# Altium schematic sheet Sheet3.SchDoc
size A; SheetNumber: 1; SheetTotal: 1
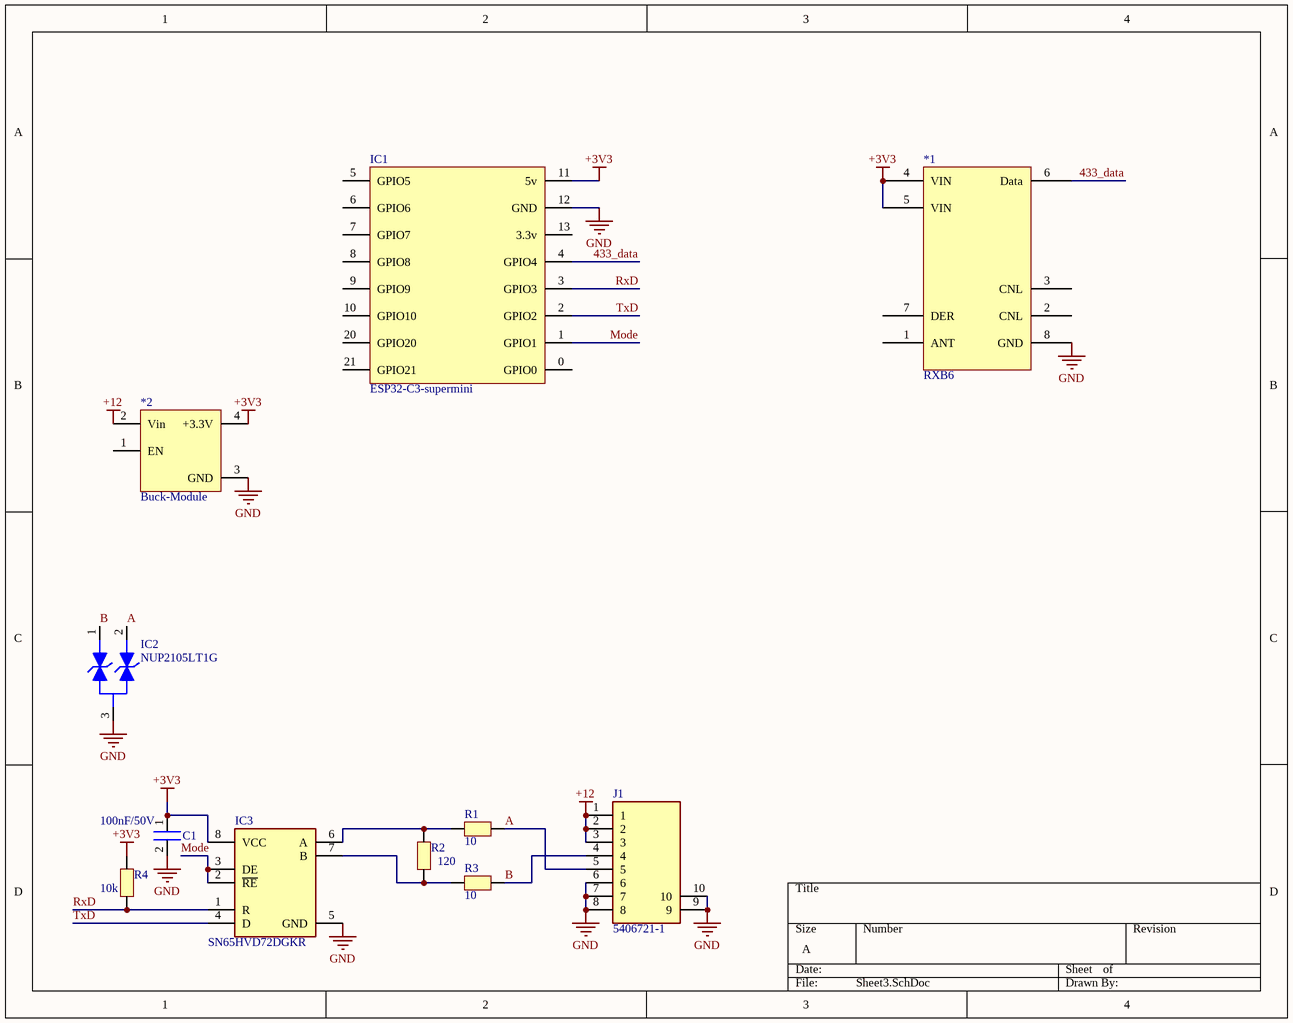
[diagram p0: Sheet3.SchDoc]

## Parts
*1  RXB6  [RXB6]
*2  Buck-Module  [Buck-Module]
C1  100nF/50V  [Resistor]
IC1  ESP32-C3-supermini  [Esp32Module]
IC2  NUP2105LT1G  [SOT96P237X111-3N]
IC3  SN65HVD72DGKR  [SOP65P490X110-8N]
J1  5406721-1  [54067211]
R1  10  [Resistor]
R2  120  [Resistor]
R3  10  [Resistor]
R4  10k  [Resistor]

## Nets
+3V3: *1.4(VIN) *1.5(VIN) *2.4(+3.3V) C1.1 IC1.11(5v) IC3.8(VCC) R4.2
+12: *2.2(Vin) J1.1 J1.2 J1.3
GND: *1.8(GND) *2.3(GND) C1.2 IC1.12(GND) IC2.3 IC3.5(GND) J1.6 J1.7 J1.8 J1.9 J1.10
433_data: *1.6(Data) IC1.4(GPIO4)
A: IC2.2 J1.5 R1.2
B: IC2.1 J1.4 R3.2
Mode: IC1.1(GPIO1) IC3.2(~{RE}) IC3.3(DE)
RxD: IC1.3(GPIO3) IC3.1(R) R4.1
TxD: IC1.2(GPIO2) IC3.4(D)
NetIC3_6: IC3.6(A) R1.1 R2.2
NetIC3_7: IC3.7(B) R2.1 R3.1

Not connected (* = marked no-connect by the designer): *1 1(ANT) 2(CNL) 3(CNL) 7(DER); *2 1(EN); IC1 0(GPIO0) 5(GPIO5) 6(GPIO6) 7(GPIO7) 8(GPIO8) 9(GPIO9) 10(GPIO10) 13(3.3v) 20(GPIO20) 21(GPIO21)

## Library data of the parts
C1 = 0603 cap
IC2 = NUP2105LT1G: Integrated Circuit; Manufacturer_Name: onsemi; Datasheet Link: https://www.onsemi.com/pub/Collateral/NUP2105L-D.PDF; Height: 1.11mm; Manufacturer_Part_Number: NUP2105LT1G; Mouser Part Number: 863-NUP2105LT1G; Mouser Price/Stock: https://www.mouser.co.uk/ProductDetail/onsemi/NUP2105LT1G?qs=ZXBb0xZ9WeDHmiHN%252BYKtYA%3D%3D; Arrow Part Number: NUP2105LT1G; Arrow Price/Stock: https://www.arrow.com/en/products/nup2105lt1g/on-semiconductor?utm_currency=USD&region=europe
IC3 = SN65HVD3085EDGKRG4: Integrated Circuit; Manufacturer_Name: Texas Instruments; Datasheet Link: http://www.ti.com/lit/ds/symlink/sn65hvd3082e.pdf; Height: 1.1mm; Manufacturer_Part_Number: SN65HVD3085EDGKRG4
J1 = 5406721-1: Connector; Manufacturer_Name: TE Connectivity; Datasheet Link: https://www.te.com/commerce/DocumentDelivery/DDEController?Action=srchrtrv&DocNm=82066_Mod_Jacks_and_MRJ21_Prod_-_Single&DocType=Catalog%20Section&DocLang=English&PartCntxt=5406721-1&DocFormat=pdf; Height: 12mm; Manufacturer_Part_Number: 5406721-1; Mouser Part Number: 571-5406721-1; Mouser Price/Stock: https://www.mouser.co.uk/ProductDetail/TE-Connectivity-AMP/5406721-1?qs=dJbzCyn%252BCFbR42PHIn9ZjQ%3D%3D; Arrow Part Number: 5406721-1; Arrow Price/Stock: https://www.arrow.com/en/products/5406721-1/te-connectivity?region=nac
R1-R4 = Resistor